# EAGLE design AST2001 (EAGLE 6.3)
DATABASE: ./../../../../../Components/TinyCircuits_Part_Database.txt
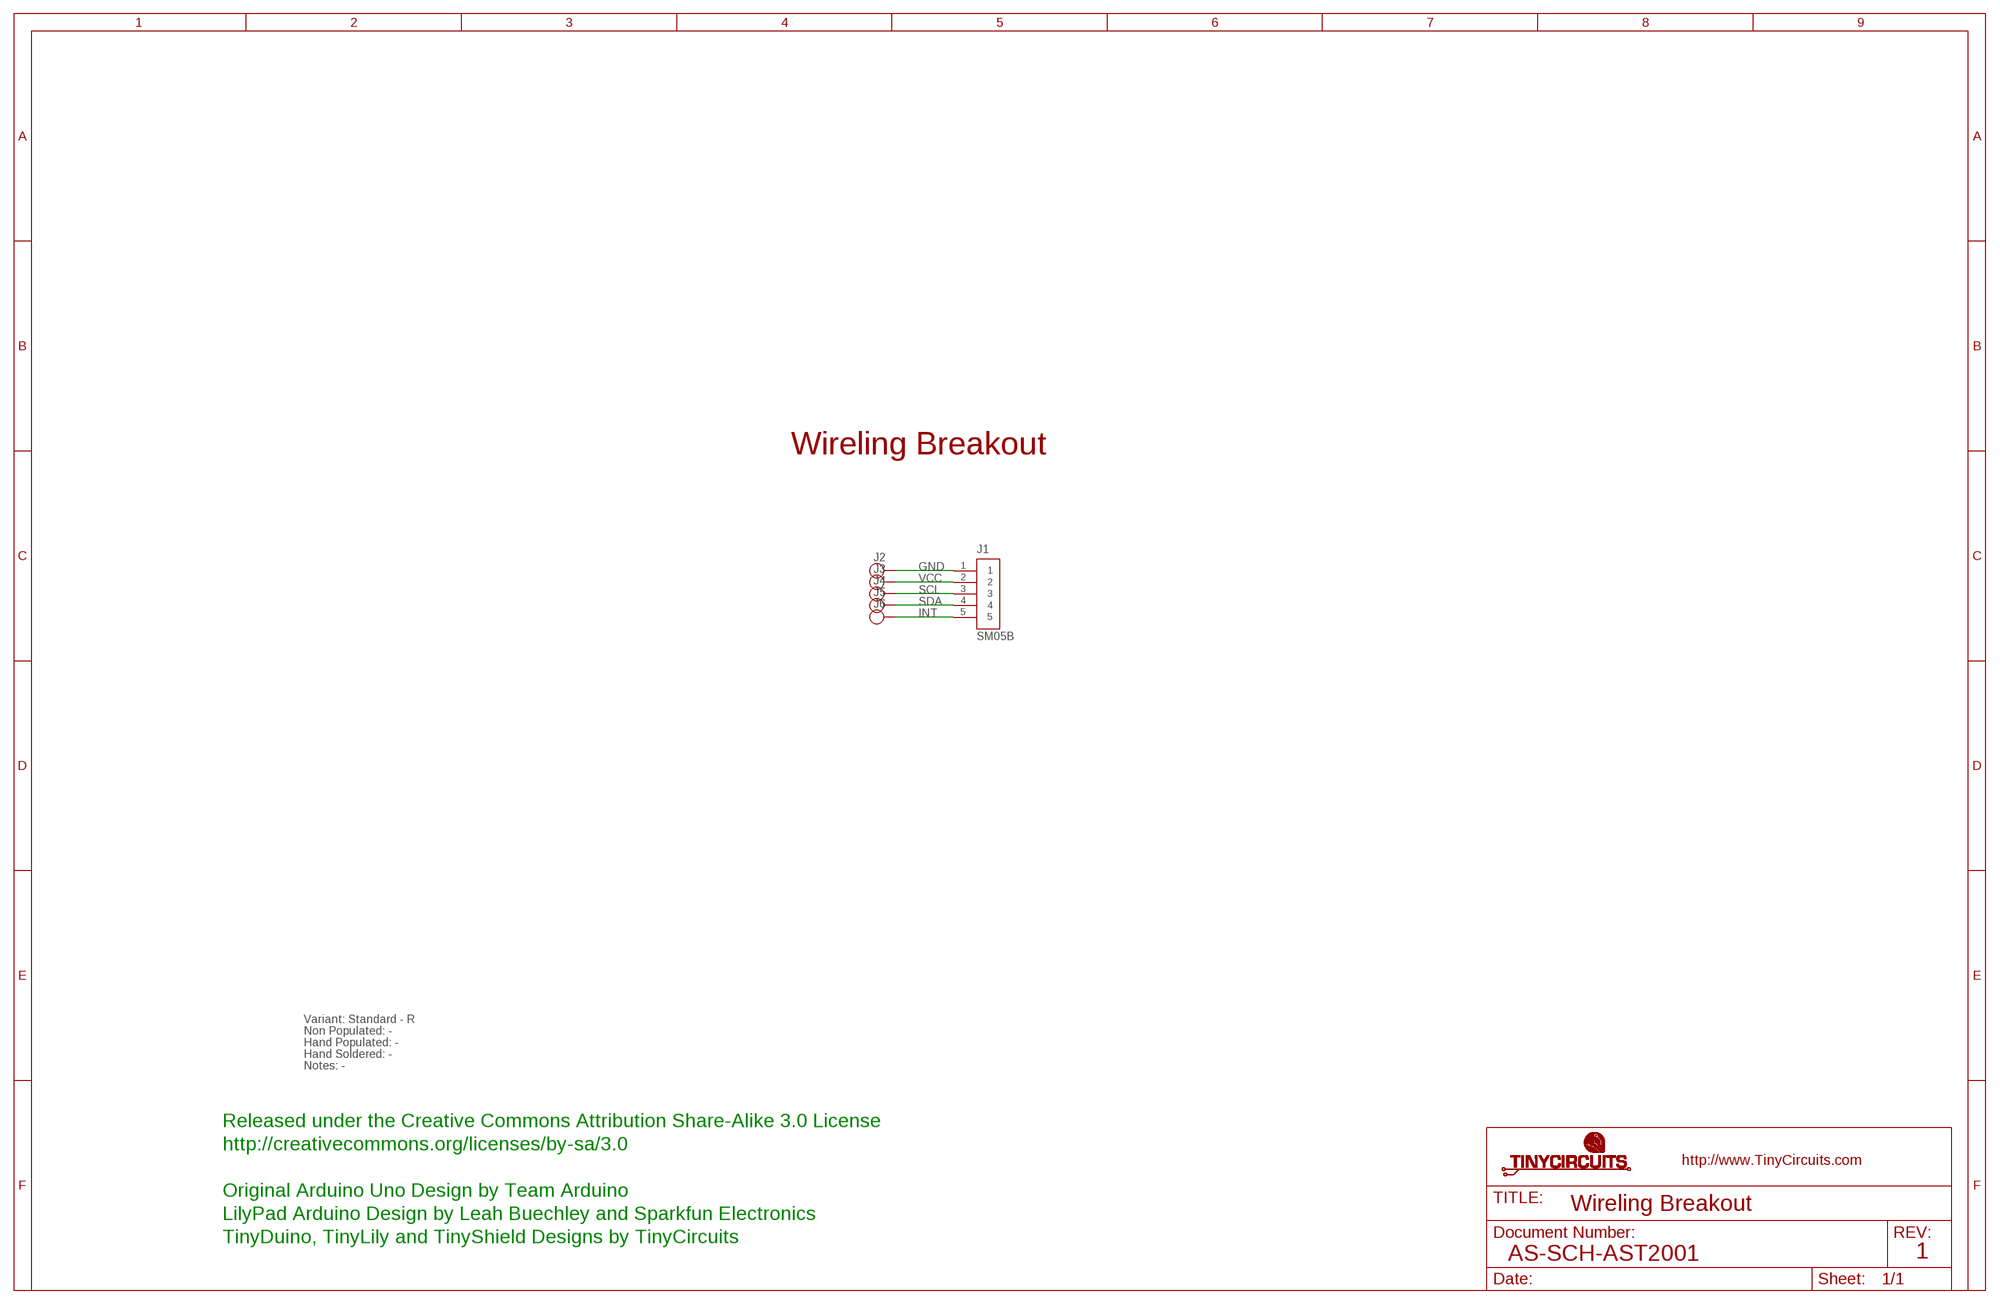
[diagram p0: schematic, sheet 1]

## Parts
J1  SM05B  AS-ITM-00340EDGE  [JST_SH_5X1_EDGE]
J2  PIN_1X.1"1  [1X.1"_2]
J3  PIN_1X.1"1  [1X.1"_2]
J4  PIN_1X.1"1  [1X.1"_2]
J5  PIN_1X.1"1  [1X.1"_2]
J6  PIN_1X.1"1  [1X.1"_2]

## Nets
GND: J1.1 J2.1
INT: J1.5 J6.1
SCL: J1.3 J4.1
SDA: J1.4 J5.1
VCC: J1.2 J3.1

## Notes on the sheet
- Wireling Breakout
- Variant: Standard - R
- Non Populated: -
- Hand Populated: -
- Hand Soldered: -
- Notes: -
- Released under the Creative Commons Attribution Share-Alike 3.0 License
- http://creativecommons.org/licenses/by-sa/3.0
- Original Arduino Uno Design by Team Arduino
- Wireling Breakout
- LilyPad Arduino Design by Leah Buechley and Sparkfun Electronics
- TinyDuino, TinyLily and TinyShield Designs by TinyCircuits
- AS-SCH-AST2001 | 1

## Library data of the parts
J1 = tinycircuits:AS-ITM-00340: CONN HEADER SH 5POS SIDE 1MM TIN; PARTNO: AS-ITM-00340; PNPROTATION: 180
J2-J6 = tinycircuits:PIN_1X.1": 1 Pin 0.100" Header

## Net classes
2 gnd: width 0.305 mm, drill 0.559 mm, clearance 0.254 mm

## Board
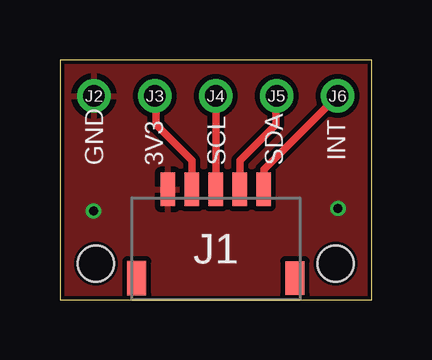
[diagram p1: board, top side]
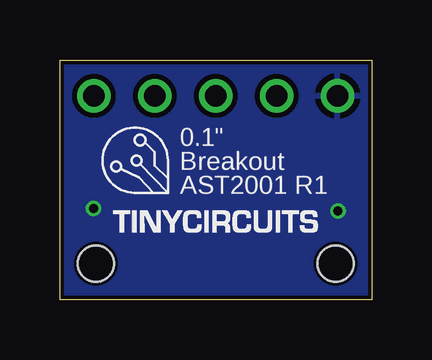
[diagram p2: board, bottom side, seen from below]

Size 13 x 10 mm. Coordinates in mm from the lower left corner, seen from the top.
Outline: 0,0 13,0 13,10 0,10 0,0
Copper layers (1*16): Top 0.035mm / dielectric 1.5mm / Bottom 0.035mm
Design rules "default *": minimum track width 8mil, minimum drill 15mil, track to track 8mil, track to pad 8mil, pad to pad 8mil, via to via 8mil, smd to smd 8mil, copper to edge 6mil, drill to drill 8mil, minimum pad ring 8mil, minimum via ring 5mil, stop-mask expansion 4mil, vias tented up to drill 25mil, thermal gap 10mil
Holes 1.5 mm at 1.5,1.5 11.5,1.5

### Footprints (pad centres in the part's own frame; a part is rotated, then mirrored left to right if it is on the bottom)
JST_SH_5X1_EDGE = smd 0.6 x 1.4: 1 -2,2.475; 2 -1,2.475; 3 0,2.475; 4 1,2.475; 5 2,2.475 | smd 0.8 x 1.4: PAD1 -3.3,-1.225; PAD2 3.3,-1.225
1X.1"_2 = drill 0.889 pad 1.397: 1 0,0

### Placement (x,y rotation side)
J1  6.5,2.12 0 top
J2  1.42,8.5 0 top
J3  3.96,8.5 0 top
J4  6.5,8.5 0 top
J5  9.04,8.5 0 top
J6  11.58,8.5 0 top
U$1  [DOCFIELD-TINYCIRCUITS-PCB]  20.5,-10 0 top  (outside the outline)

### Tracks (layer width: path | path; a pad name or v marks a point on that pad's centre or on a via)
GND  (via drill 0.38)
  other vias: 1.4,3.7 11.6,3.8
  pour Bottom: 0,10 13,10 13,0 0,0
  pour Top: 0,10 13,10 13,0 0,0
INT
  Top 0.305: J1.5 8.5,5.42 J6.1
SCL
  Top 0.305: J1.3 J4.1
SDA
  Top 0.305: J1.4 7.5,5.8 9,7.3 9,8.46 J5.1
VCC
  Top 0.305: J1.2 5.5,5.8 4,7.3 4,8.46 J3.1

### Text on the board
tPlace: GND | 3V3 | SCL | SDA | INT
bPlace: 0.1" | Breakout | AST2001 R1
Document: FABRICATION DRAWING | NOTES: | 1. PRINTED CIRCUIT BOARD MADE FROM NEMA GRADE FR-4 EPOXY LAMINATE | WITH 1 OUNCE COPPER PLATING AND .024 THICKNESS. | 2. ALL DIMENSIONS ARE GIVEN IN MILLIMETERS. | 3. CIRCUIT PATHS ARE FOR REFERENCE ONLY. | 4. HOLE SIZES SHOWN ARE FINISHED DIAMETERS AFTER PLATING. | 5. BOARD PLATED USING REFLOW OR SIMILAR METHOD. | 6. BOARD TO HAVE BLUE SOLDER MASK ON PLATED SURFACES USING WET FILM | 7. SILKSCREEN BOARD USING WHITE INK. | SR100 OR SR1010 EPOXY. EQUIVALENT WET OR DRY FILM MAY BE USED. | 8. THE FOLLOWING INFORMATION APPLIES TO THIS BOARD: | * 2 COPPER LAYERS | * .024 BOARD THICKNESS | * REQUIRES TOP SIDE SILKSCREEN | Released under the Creative Commons Attribution Share-Alike 3.0 License | http://creativecommons.org/licenses/by-sa/3.0 | Original Arduino Uno Design by Team Arduino | LilyPad Arduino Design by Leah Buechley and Sparkfun Electronics | TinyDuino, TinyLily and TinyShield Designs by TinyCircuits | Wireling Breakout | AS-PCB-AST2001 | 1